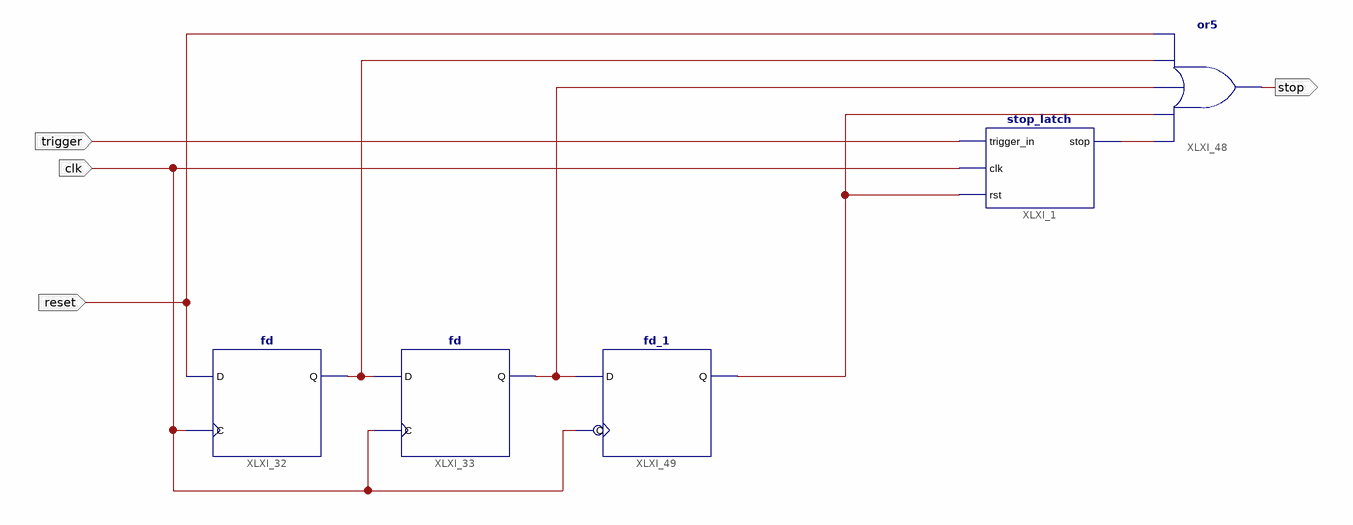
[diagram p0: schematic sheet 1]
// Xilinx ISE schematic stoplatch_SCH(1).sch (spartan3a) as structural Verilog: 5 symbols, 4 ports
module \stoplatch_SCH(1)  (
  input  trigger,
  input  clk,
  input  reset,
  output stop
);

  wire XLXN_161, XLXN_163, XLXN_164, XLXN_167;

  stop_latch XLXI_1 (.trigger_in(trigger), .clk(clk), .rst(XLXN_167), .stop(XLXN_161));
  fd XLXI_33 (.C(clk), .D(XLXN_164), .Q(XLXN_163));
  fd XLXI_32 (.C(clk), .D(reset), .Q(XLXN_164));
  or XLXI_48 (stop, XLXN_161, XLXN_167, XLXN_163, XLXN_164, reset);
  fd_1 XLXI_49 (.C(clk), .D(XLXN_163), .Q(XLXN_167));
endmodule
